# EAGLE board SDA381V3 (EAGLE 9.6.2), part 1 of 5
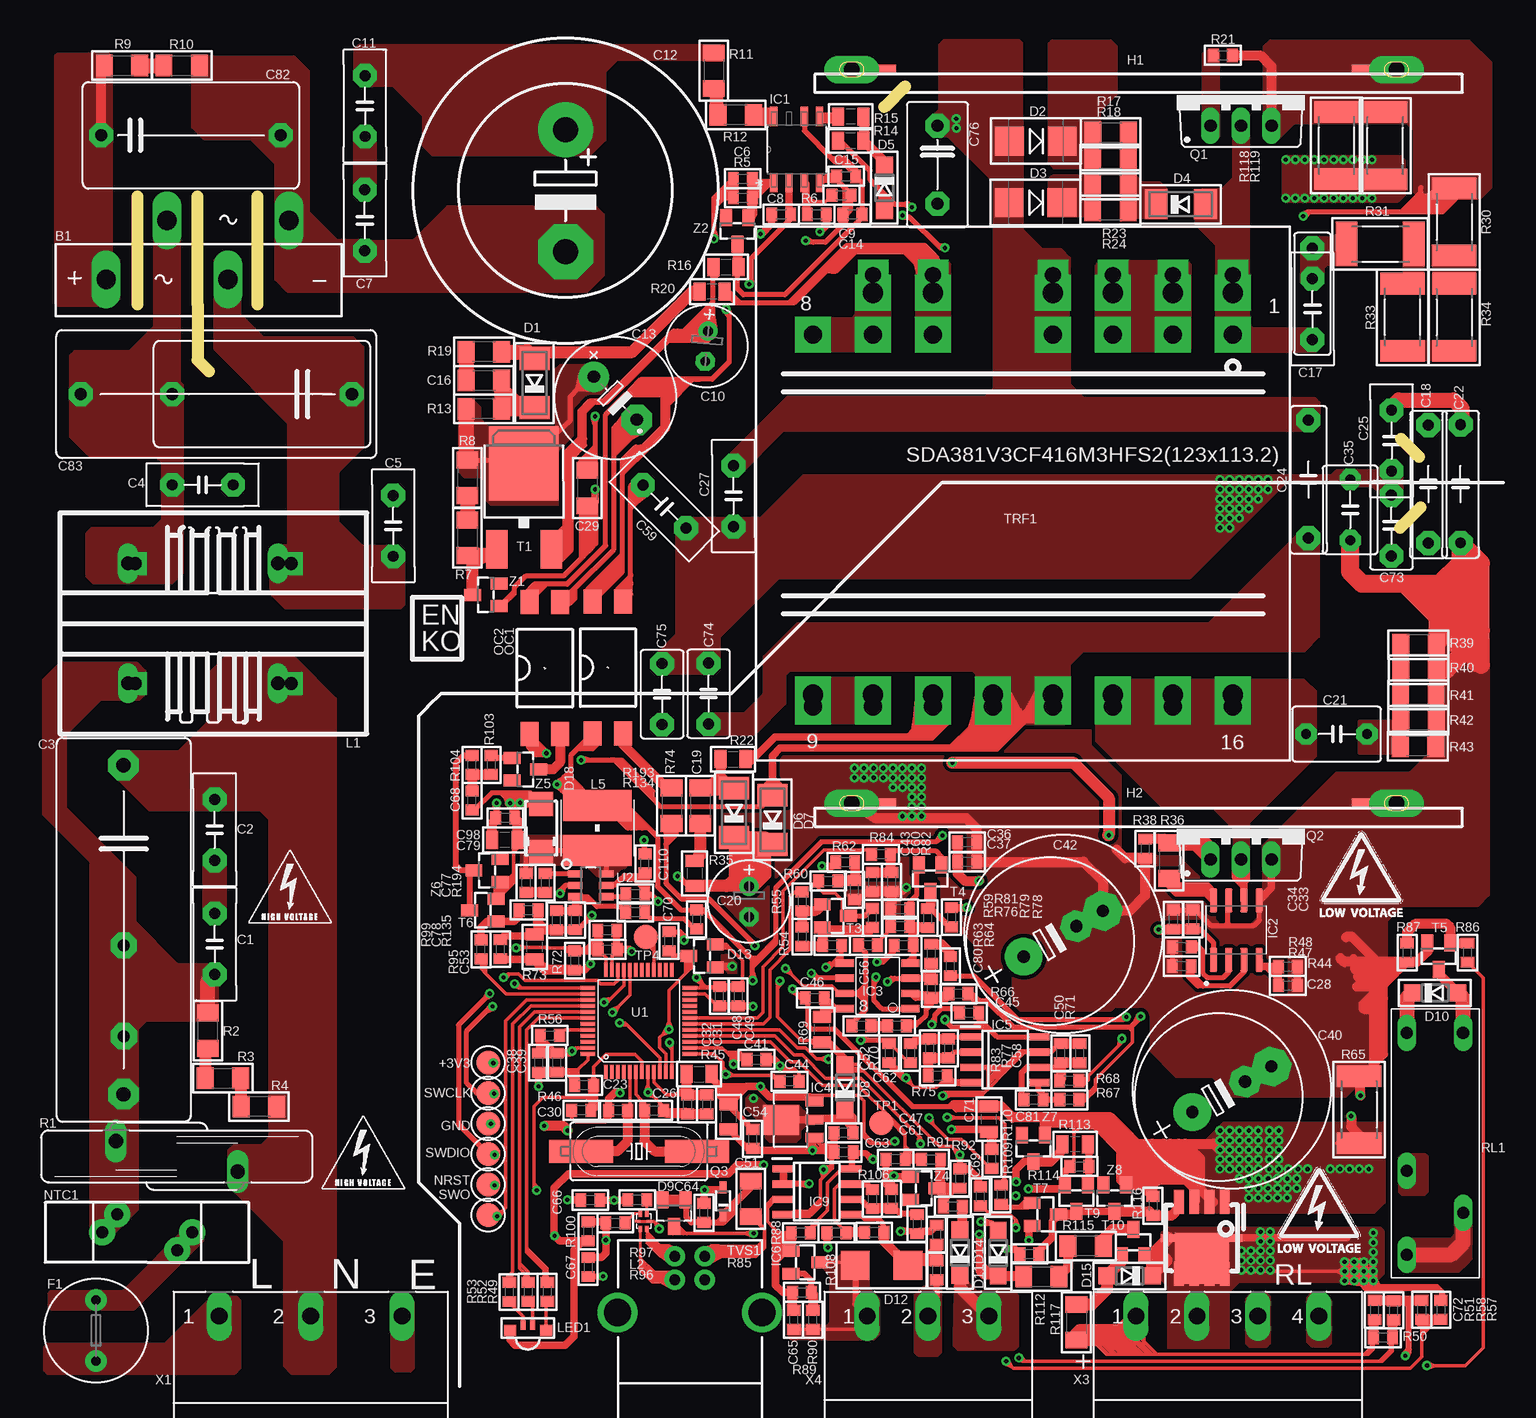
[diagram p3: board, top side]
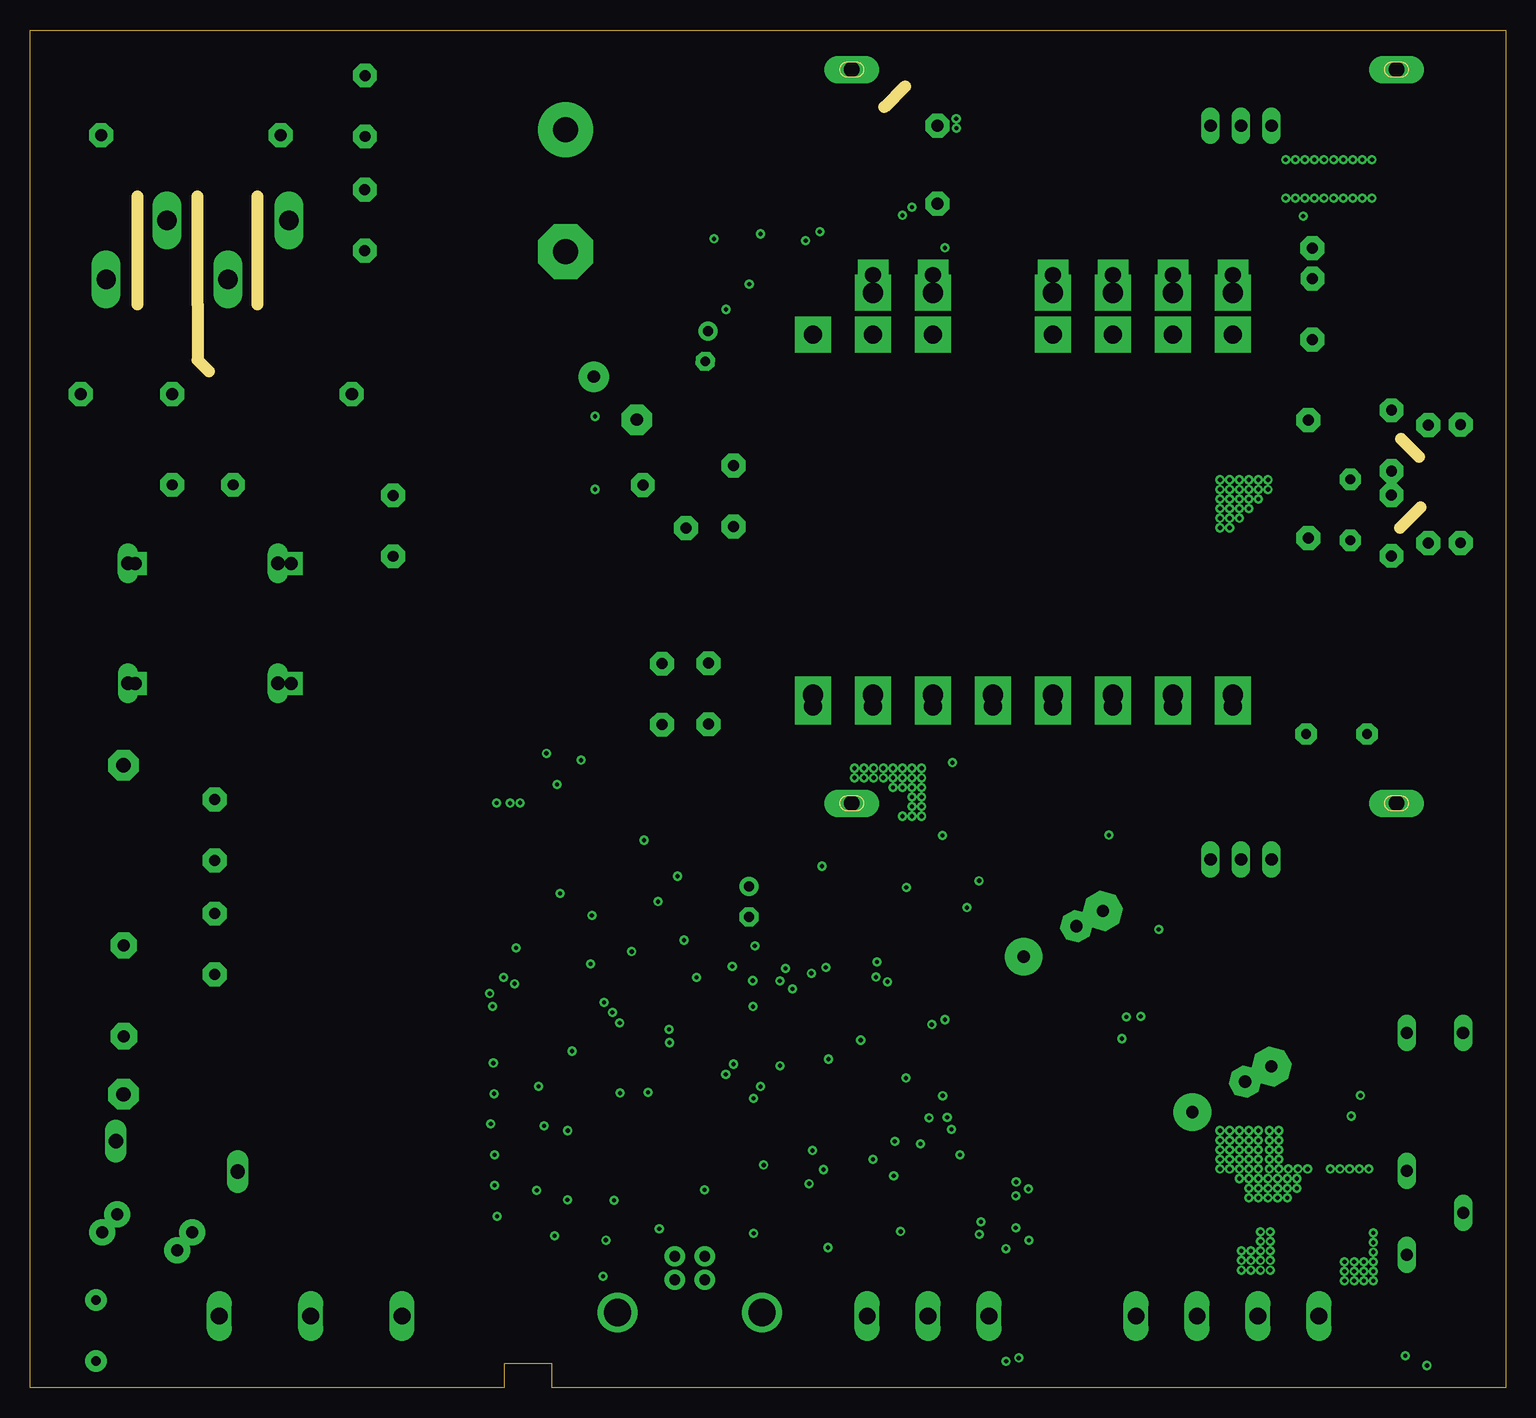
[diagram p4: board, inner layer Route3]
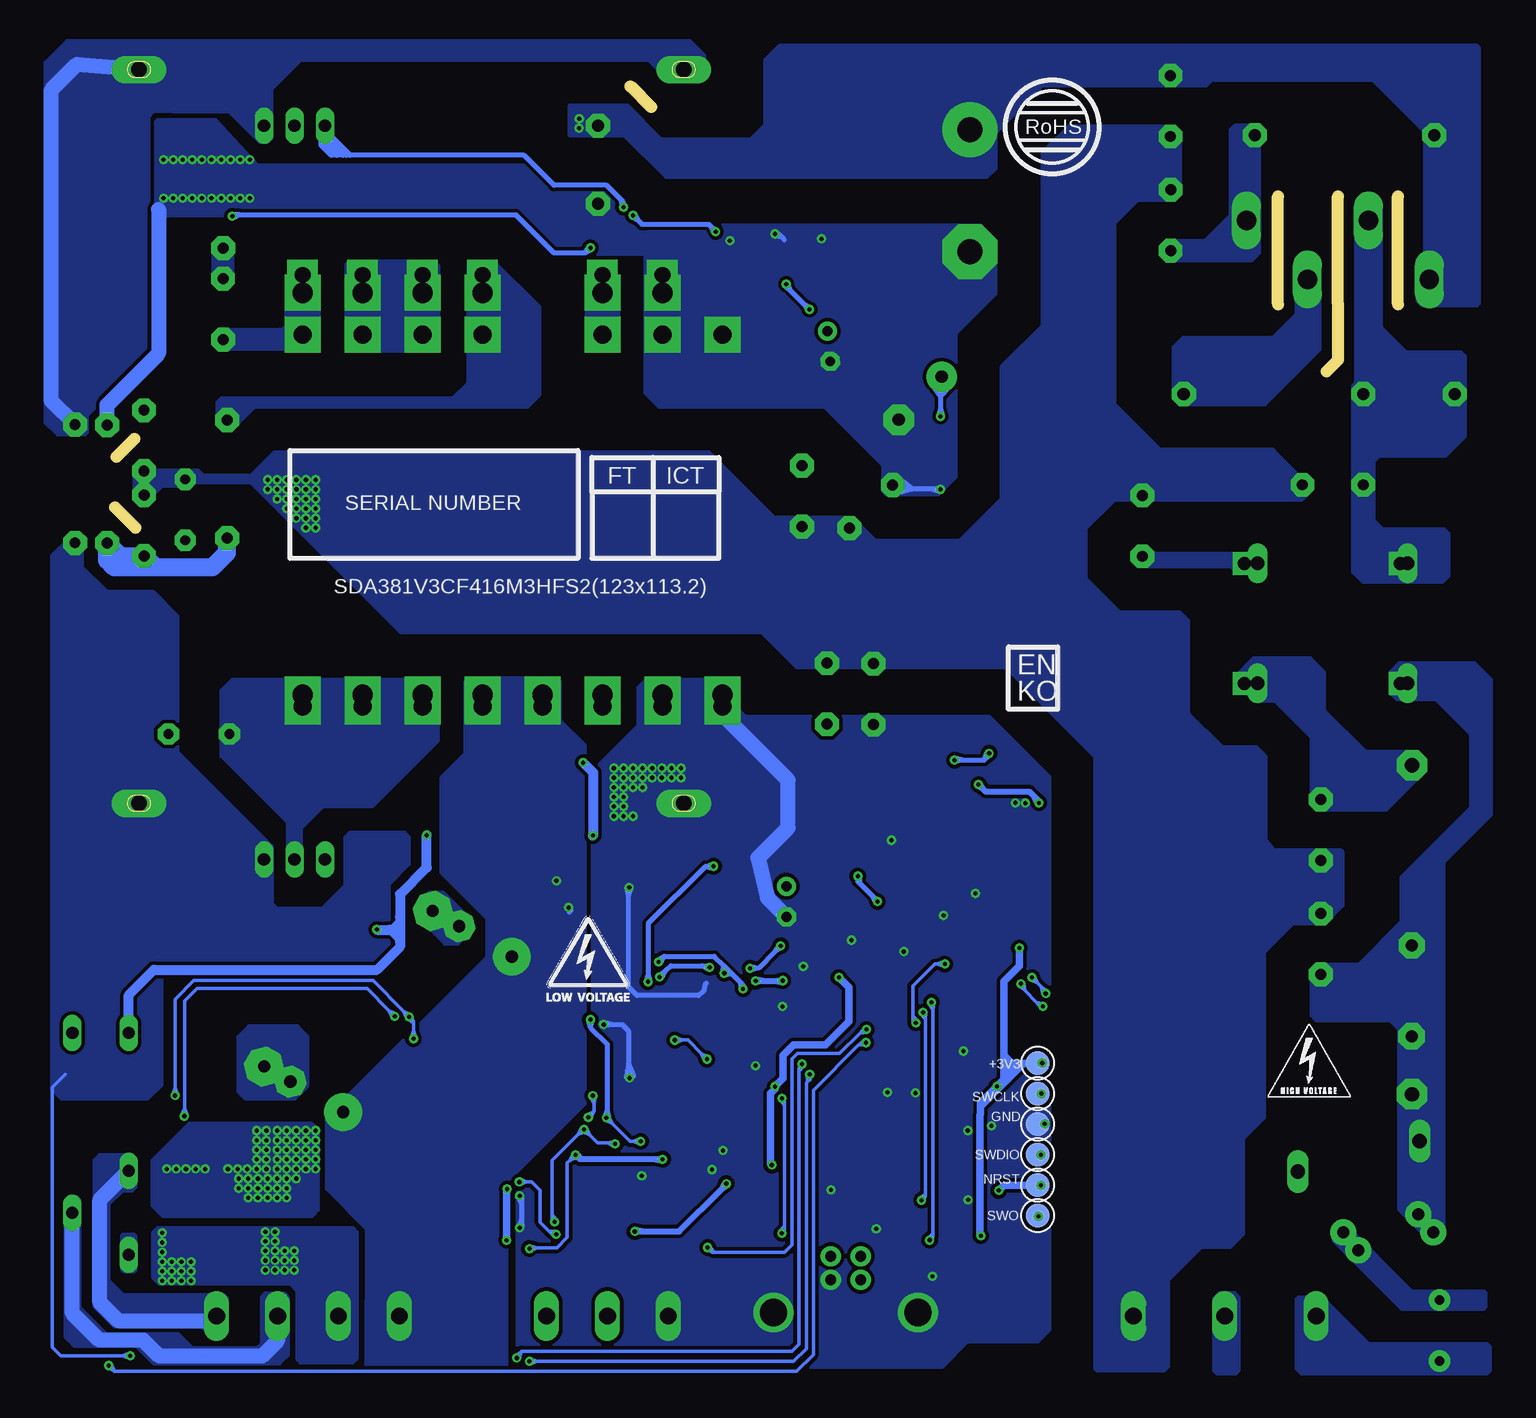
[diagram p5: board, bottom side, seen from below]

No outline drawn. Coordinates in mm, seen from the top.
Copper layers (1*16): Top 0.035mm / dielectric 1.53mm / Bottom 0.035mm
Design rules "default *": minimum track width 10mil, minimum drill 0.008890625mm, track to track 11mil, track to pad 11mil, pad to pad 11mil, via to via 11mil, smd to smd 11mil, copper to edge 6mil, drill to drill 8mil, minimum pad ring 10mil, minimum via ring 8mil, stop-mask expansion 4mil, vias tented up to drill 0.35mm, thermal gap 10mil
Milling: 5 lines

## Footprints (pad centres in the part's own frame; a part is rotated, then mirrored left to right if it is on the bottom)
DıODE_BRIDGE_8A_DIK = drill 1.6 long: + -7.62,0.08; - 7.62,5; AC1 -2.54,5; AC2 2.54,0.08
C50-035X75 = drill 0.914 pad 1.981 octagon: 1 -2.54,0; 2 2.54,0
C275-113X316_&_C150-072X183_&_C225-113X268 = drill 1.194 pad 2.54 octagon: 1 -13.716,0; 2 13.716,0 | drill 1.016 pad 2.184 octagon: 3 -13.733,0.02; 4 8.873,0.02; 5 -13.693,0; 6 1.293,0
C0603_ENKO = smd 0.9 x 1.1: 1 -0.794,0; 2 0.794,0
E2,5-7 = drill 0.813 pad 1.6: + -1.27,0 | drill 0.813 pad 1.6 octagon: - 1.27,0
EB25D = drill 2.1 pad 4.597: + -5.08,0 | drill 2.1 pad 4.597 octagon: - 5.08,0
E5-10,5 = drill 1.016 pad 2.54: + -2.54,0 | drill 1.016 pad 2.54 octagon: - 2.54,0
C1206_ENKO = smd 1.4 x 1.8: 1 -1.479,0; 2 1.479,0
C075-32X103/C050-035X75 = drill 0.914 pad 2 octagon: 1 -3.81,0; 2 3.81,0 | drill 0.914 pad 1.981 octagon: 3 -3.81,0; 4 1.27,0
C075-32X103_DEIF = drill 0.914 pad 2 octagon: P$1 -4.92,0; P$2 4.92,0
C050-045X075 = drill 0.813 pad 1.778 octagon: 1 -2.54,0; 2 2.54,0
E5-13/E7,5-16 = drill 1.016 pad 3.15: + -3.81,0 | drill 1.016 pad 2.54: +1 -3.81,0 | drill 1.016 pad 3.15 octagon: - 3.81,0 | drill 1.016 pad 2.54 octagon: -1 1.27,0
C0805_ENKO = smd 1 x 1.5: 1 -1.052,0; 2 1.052,0
C050-035X075 = drill 0.914 pad 1.981 octagon: 1 -2.54,0; 2 2.54,0
C065-052X106 = drill 1 pad 2 octagon: 1 -3.25,0; 2 3.25,0
C150-091X182 = drill 1 pad 2 octagon: 1 -7.493,0; 2 7.493,0
C150-091X182_C225-108X268 = drill 1.016 pad 2 octagon: 1 -11.303,0; 2 11.303,0; 3 -11.303,0; 4 3.683,0
M7_DC_DIYOT = smd 1.9 x 2.5: A -2.05,0; C 2.05,0
SMB = smd 2.4 x 2.4: A 2.2,0; C -2.2,0
SOD123 = smd 1.4 x 1.4: A 1.9,0; C -1.9,0
SOT23 = smd 1 x 1.4: 1 -0.95,-1.1; 2 0.95,-1.1; 3 0,1.1
TRANSIL_SMB = smd 2.4 x 2.4: A 2.2,0; A1 -2.2,0
SMA = smd 2 x 2: A 2,0; C -2,0
SENS_FUSE = drill 0.813 pad 1.778: 1 -2.54,0; 2 2.54,0
DEIF_SOGUTUCU_2 = drill 1.3 pad 2.3 long: 1 -23.9,0.91; 3 21.5,0.91 | smd 4.3 x 0.8: 2 -22.35,0.91; 4 19.95,0.91
NCP1239_SMPS_IC = smd 1.6 x 0.6: 1 -2.76,1.905; 2 -2.76,0.635; 3 -2.76,-0.635; 4 -2.76,-1.905; 5 2.76,-1.905; 6 2.76,-0.635; 8 2.76,1.905
NCP4306 = smd 1.97 x 0.6: 1 -2.475,1.905; 2 -2.475,0.635; 3 -2.475,-0.635; 4 -2.475,-1.905; 5 2.475,-1.905; 6 2.475,-0.635; 7 2.475,0.635; 8 2.475,1.905
SO-8 = smd 1.524 x 0.61: 1 -2.743,1.92; 2 -2.743,0.65; 3 -2.743,-0.62; 4 -2.743,-1.89; 5 2.743,-1.89; 6 2.743,-0.62; 7 2.743,0.65; 8 2.743,1.92
SOT89 = smd 0.8 x 1.5: 1 -1.5,-1.75; 2 0,-1.75; 3 1.5,-1.75 | smd 2.5 x 3: 4 0,1.05
SO08 = smd 0.6 x 1.8: 1 -1.905,-2.8; 2 -0.635,-2.8; 3 0.635,-2.8; 4 1.905,-2.8; 5 1.905,2.8; 6 0.635,2.8; 7 -0.635,2.8; 8 -1.905,2.8
TL431_SOT23F = smd 1 x 1.4: A 0,1.2; C -0.95,-1.2; R 0.95,-1.2
TPH6R30ANL = smd 0.8 x 2: D 1.905,3; D1 0.635,3; D2 -0.635,3; D3 -1.905,3; GATE 1.905,-3; S -1.905,-3; S1 -0.635,-3; S2 0.635,-3 | smd 1.27 x 0.635: P$1 -2.75,0; P$2 2.75,0 | smd 4.5 x 4.25: P$3 0,1.7
UU1620_&_FWCMET24V = drill 1.1 pad 1.93 square: 1 -5,-6.5; 2 5,-6.5; 3 -5,6.5; 4 5,6.5 | drill 1.118 long: 5 -5,-5.385; 6 5,-5.385; 7 4.999,7.115; 8 -5.001,7.113
EXC24CS_COMMON_MODE = smd 0.4 x 0.2: 1 -0.5,0; 4 0.5,0 | smd 0.3 x 0.5: 2 -0.275,-0.625; 3 0.275,-0.625; 5 0.275,0.625; 6 -0.275,0.625
WE-PD2_5MM = smd 2.55 x 5.7: 1 -1.875,0; 2 1.875,0
KPFA-3010RGBC-11 = smd 1 x 0.9: 1 1.5,-0.2; 2 -1.5,-0.2 | smd 0.4 x 0.8: 3 -0.4,0.25; 4 0.4,0.25
NTC_15R_2A_&_N15SP005-5 = drill 1 pad 2.184: P$1 -2.5,1.5; P$2 2.5,-1.5; P$3 3.75,0; P$4 -3.75,0
PS2561DL2-1_OPTO1 = smd 1.5 x 2: 1 -1.27,-5.5; 2 1.27,-5.5; 3 1.27,5.5; 4 -1.27,5.5
PROG_6PIN = smd 2 x 2: 1 0,6.35; 2 0,3.81; 3 0,1.27; 4 0,-1.27; 5 0,-3.81; 6 0,-6.35
TO220BV = drill 1.016 long: D 0,-2.54; G -2.54,-2.54; S 2.54,-2.54
HC49UP = smd 5.334 x 1.93: 1 -4.826,0; 2 4.826,0
S20K40 = drill 1.194 long: 1 -1.27,-5.08; 2 1.27,5.08
R1206_ENKO = smd 1.4 x 1.8: 1 -1.479,0; 2 1.479,0
R0603_ENKO = smd 0.9 x 1.1: 1 -0.794,0; 2 0.794,0
R0805_ENKO = smd 1 x 1.5: 1 -1.052,0; 2 1.052,0
R2512 = smd 1.8 x 3.7: 1 -2.8,0; 2 2.8,0
ALD1_AND_ALJ_RELAY = drill 1.016 pad 1.27 long: 1 -8.997,-2.129; 2 -8.998,2.565; P0 9.505,-2.132; P1 6.007,2.571; S0 2.507,-2.129
DPAK = smd 1.8 x 3.2: 1 -2.28,-4.8; 3 2.28,-4.8 | smd 5.8 x 6.2: 4 0,2.38
SOT23-BEC = smd 1 x 1.4: B -0.95,-1.1; C 0,1.1; E 0.95,-1.1
TP20R = smd 2 x 2: TP 0,0
DEIF_TRF = drill 1.7 pad 3 square: 1 -16.75,12.5; 2 -16.75,7.5; 3 -16.75,2.5; 5 -16.75,-7.5; 6 -16.75,-12.5; 6.5 16.75,-17.5; 7 16.75,-12.5; 8 16.75,-7.5; 9 16.75,-2.5; 10 16.75,2.5; 11 16.75,7.5; 12 16.75,12.5; 13 16.75,17.5; 55 -16.75,17.5 | drill 1.5 pad 3 square: 6.1 17.745,-17.5; 6.2 16.75,-17.5; 19 17.745,12.5; 20 17.745,7.5; 21 17.745,2.5; 22 17.745,-2.5; 23 17.745,-7.5; 24 17.745,-12.5; 25 17.745,17.5; 27 16.75,-12.5; 28 16.75,-7.5; 29 16.75,-2.5; 30 16.75,2.5; 31 16.75,7.5; 32 16.75,12.5; 38 16.75,17.5; 40 16.75,-17.5; 41 16.75,-12.5; 42 16.75,-7.5; 43 16.75,-2.5; 44 16.75,2.5; 45 16.75,7.5; 46 16.75,12.5; 47 16.75,17.5; 48 -13.25,-17.5; 49 -13.25,-12.5; 50 -13.25,-7.5; 52 -13.25,2.5; 53 -13.25,7.5; 54 -13.25,12.5; 58 -13.25,17.5 | drill 1.3 pad 2.54 square: 14 -18.255,-12.5; 15 -18.255,-7.5; 16 -18.255,2.5; 17 -18.255,7.5; 18 -18.255,12.5; 33 -18.25,-12.5; 34 -18.25,-7.5; 35 -18.25,2.5; 36 -18.25,7.5; 37 -18.25,12.5; 56 -18.255,17.5; 57 -18.25,17.5
SOD323 = smd 1 x 0.6: A 1.143,0; C -1.143,0
STM32F072CXXX_LQFP48 = smd 0.3 x 1.2: 1 -2.75,-4.25; 2 -2.25,-4.25; 3 -1.75,-4.25; 4 -1.25,-4.25; 5 -0.75,-4.25; 6 -0.25,-4.25; 7 0.25,-4.25; 8 0.75,-4.25; 9 1.25,-4.25; 10 1.75,-4.25; 11 2.25,-4.25; 12 2.75,-4.25; 25 2.75,4.25; 26 2.25,4.25; 27 1.75,4.25; 28 1.25,4.25; 29 0.75,4.25; 30 0.25,4.25; 31 -0.25,4.25; 32 -0.75,4.25; 33 -1.25,4.25; 34 -1.75,4.25; 35 -2.25,4.25; 36 -2.75,4.25 | smd 1.2 x 0.3: 13 4.25,-2.75; 14 4.25,-2.25; 15 4.25,-1.75; 16 4.25,-1.25; 17 4.25,-0.75; 18 4.25,-0.25; 19 4.25,0.25; 20 4.25,0.75; 21 4.25,1.25; 22 4.25,1.75; 23 4.25,2.25; 24 4.25,2.75; 37 -4.25,2.75; 38 -4.25,2.25; 39 -4.25,1.75; 40 -4.25,1.25; 41 -4.25,0.75; 42 -4.25,0.25; 43 -4.25,-0.25; 44 -4.25,-0.75; 45 -4.25,-1.25; 46 -4.25,-1.75; 47 -4.25,-2.25; 48 -4.25,-2.75
AOZ1282CI-1 = smd 1.2 x 0.6: 1 -1.298,0.95; 2 -1.298,0; 3 -1.298,-0.95; 4 1.298,-0.95; 5 1.298,0; 6 1.298,0.95
GMSTBA3 = drill 1.397 long: 1 -7.62,5.08; 2 0,5.08; 3 7.62,5.08
USB_B(YATIK) = drill 0.914 pad 1.676: D+ 4,1.25; D- 5.981,1.25; GND 4,-1.25; VBUS 5.981,-1.25 | drill 2.286: SHLD1 1.282,-6.02; SHLD2 1.282,6.02
MSTBA4 = drill 1.397 long: 1 -7.62,5.08; 2 -2.54,5.08; 3 2.54,5.08; 4 7.62,5.08
MSTBA3 = drill 1.397 long: 1 -5.08,5.08; 2 0,5.08; 3 5.08,5.08

## Placement (x,y rotation side)
B1  0119-1152**DIODE BRIDGE 8A 800V 4-SIP, GBU  [DıODE_BRIDGE_8A_DIK]  -109.03,92.33 0 top
C1  NC**TAKILMAYACAK (Not Fitted)  [C50-035X75]  -107.6,37 270 top
C2  NC**TAKILMAYACAK (Not Fitted)  [C50-035X75]  -107.61,46.52 90 top
C3  0019-2209**CAP TH POLY 2.2uF 305Vac %10 X2 Metalize PP F=27.5mm (32x25x13)  [C275-113X316_&_C150-072X183_&_C225-113X268]  -115.19,38.19 270 top
C4  0019-1391**CAP TH CER 4700pF 250VAC 2.5kVDC X1Y2 %20 85C F=5mm  [C50-035X75]  -108.61,75.28 180 top
C5  0019-1391**CAP TH CER 4700pF 250VAC 2.5kVDC X1Y2 %20 85C F=5mm  [C50-035X75]  -92.72,71.87 90 top
C6  1200920252**CAP 0603 CER 1nF 50V %10 X7R  [C0603_ENKO]  -63.58,100.8 180 top
C7  0019-1391**CAP TH CER 4700pF 250VAC 2.5kVDC X1Y2 %20 85C F=5mm  [C50-035X75]  -95.09,97.35 270 top
C8  1200920252**CAP 0603 CER 1nF 50V %10 X7R  [C0603_ENKO]  -60.38,97.83 180 top
C9  1200920371**CAP 0603 CER 150p 50V%5 COG  [C0603_ENKO]  -55.36,99.42 180 top
C10  0019-2279**CAP TH AL ELEC 47uF 50V %20 105C F=2.5/6.3x11 Low ESR, High Ripple Current  [E2,5-7]  -66.6,86.84 265 top
C11  0019-1391**CAP TH CER 4700pF 250VAC 2.5kVDC X1Y2 %20 85C F=5mm  [C50-035X75]  -95.08,106.86 90 top
C12  0019-3039**150uF 450V 105C %20 Ba:10 Yu: 41,5 çap: 25  [EB25D]  -78.36,99.81 270 top
C13  0019-2196**CAP TH AL ELEC 47uF 100V %20 105C F=5/10x16  [E5-10,5]  -74.21,82.5 315 top
C14  1200920567**CAP 0603 CER 1uF 25V %10X7R  [C0603_ENKO]  -54.44,97.83 180 top
C15  1200920268**CAP 0603 CER 100nF 50V %10 X7R  [C0603_ENKO]  -54.97,101 180 top
C16  NC**TAKILMAYACAK (Not Fitted)  [C1206_ENKO]  -85.16,83.98 180 top
C17  0019-5004**CAP TH CER 100pF 1kV Y5V %10 85C F=5  [C075-32X103/C050-035X75]  -16.09,91.21 90 top
C18  1200920292**CAP TH CER 2.2nF 300Vac %20 X1Y2 F=7.5mm DxS(13x5)  [C075-32X103_DEIF]  -6.42,75.36 90 top
C19  1200920078**CAP 1206 CER 1nF 50V %10 X7R  [C1206_ENKO]  -67.14,48.54 90 top
C20  1200920283**CAP TH AL. ELEC 47uF 50V %20 105C L?1000H F=2.5/6.3x11  [E2,5-7]  -63.06,40.54 270 top
C21  0019-3003**CAP TH CER 3.3nF 2000VDC %10 Y5P/Y5E F=5mm  [C050-045X075]  -14.08,54.51 0 top
C22  NC**TAKILMAYACAK (Not Fitted)  [C075-32X103_DEIF]  -3.75,75.37 90 top
C23  1019-3352**CAP 0603 CER 22pF 50V %5 NPO  [C0603_ENKO]  -73.99,23.15 180 top
C24  NC**TAKILMAYACAK (Not Fitted)  [C075-32X103_DEIF]  -16.43,75.75 90 top
C25  NC**TAKILMAYACAK (Not Fitted)  [C50-035X75]  -9.5,78.96 90 top
C26  1019-3352**CAP 0603 CER 22pF 50V %5 NPO  [C0603_ENKO]  -70.98,23.13 0 top
C27  NC**TAKILMAYACAK (Not Fitted)  [C50-035X75]  -64.36,74.35 90 top
C28  1200920268**CAP 0603 CER 100nF 50V %10 X7R  [C0603_ENKO]  -18.14,33.54 180 top
C29  NC**TAKILMAYACAK (Not Fitted)  [C1206_ENKO]  -76.53,75.01 90 top
C30  1200920268**CAP 0603 CER 100nF 50V %10 X7R  [C0603_ENKO]  -77.05,23.15 0 top
C31  1200920268**CAP 0603 CER 100nF 50V %10 X7R  [C0603_ENKO]  -66.59,23.63 270 top
C32  1019-3167**CAP 0603 CER 10nF 50V %10 X7R (AbC)  [C0603_ENKO]  -68.19,23.63 270 top
C33  1200920268**CAP 0603 CER 100nF 50V %10 X7R  [C0603_ENKO]  -26.08,39.04 270 top
C34  1200920567**CAP 0603 CER 1uF 25V %10X7R  [C0603_ENKO]  -27.69,39.04 270 top
C35  0019-1391**CAP TH CER 4700pF 250VAC 2.5kVDC X1Y2 %20 85C F=5mm  [C050-045X075]  -12.94,73.2 90 top
C36  1200920268**CAP 0603 CER 100nF 50V %10 X7R  [C0603_ENKO]  -44.88,45.49 0 top
C37  1200920268**CAP 0603 CER 100nF 50V %10 X7R  [C0603_ENKO]  -44.88,43.86 0 top
C38  1200920268**CAP 0603 CER 100nF 50V %10 X7R  [C0603_ENKO]  -80.59,27.11 90 top
C39  1019-3167**CAP 0603 CER 10nF 50V %10 X7R (AbC)  [C0603_ENKO]  -79.09,27.12 90 top
C40  0019-3054**CAP TH AL ELEC 1000uF 35V %20 105C F=5/16x20 LOW ESR [ARGE?]  [E5-13/E7,5-16]  -22.81,24.89 30 top
C41  1200920268**CAP 0603 CER 100nF 50V %10 X7R  [C0603_ENKO]  -62.43,27.37 0 top
C42  0019-3054**CAP TH AL ELEC 1000uF 35V %20 105C F=5/16x20 LOW ESR [ARGE?]  [E5-13/E7,5-16]  -36.87,37.86 30 top
C43  1019-3387**CAP 0603 CER 10uF 10V %10 X5R  [C0603_ENKO]  -54.28,41.52 90 top
C44  1200920268**CAP 0603 CER 100nF 50V %10 X7R  [C0603_ENKO]  -59.7,25.56 0 top
C45  1200920268**CAP 0603 CER 100nF 50V %10 X7R  [C0603_ENKO]  -44.7,31.28 180 top
C46  1200920268**CAP 0603 CER 100nF 50V %10 X7R  [C0603_ENKO]  -57.58,32.51 0 top
C47  1200920567**CAP 0603 CER 1uF 25V %10X7R  [C0603_ENKO]  -55.18,21.27 180 top
C48  1019-3167**CAP 0603 CER 10nF 50V %10 X7R (AbC)  [C0603_ENKO]  -65.53,32.65 270 top
C49  1200920268**CAP 0603 CER 100nF 50V %10 X7R  [C0603_ENKO]  -63.97,32.65 270 top
C50  NC**TAKILMAYACAK (Not Fitted)  [C0603_ENKO]  -37.08,27.91 90 top
C51  1200920268**CAP 0603 CER 100nF 50V %10 X7R  [C0603_ENKO]  -62.76,20.76 270 top
C52  1200920567**CAP 0603 CER 1uF 25V %10X7R  [C0603_ENKO]  -53.7,30.2 180 top
C53  1200920268**CAP 0603 CER 100nF 50V %10 X7R  [C0603_ENKO]  -83.79,36.57 90 top
C54  1019-3301**CAP 0805 47uF 6.3V %20 X5R  [C0805_ENKO]  -64.77,22.59 270 top
C55  1019-3167**CAP 0603 CER 10nF 50V %10 X7R (AbC)  [C0603_ENKO]  -74.86,36.54 0 top
C56  1019-3167**CAP 0603 CER 10nF 50V %10 X7R (AbC)  [C0603_ENKO]  -53.14,36.9 180 top
C57  1200920268**CAP 0603 CER 100nF 50V %10 X7R  [C0603_ENKO]  -74.88,38.15 0 top
C58  1200920371**CAP 0603 CER 150p 50V%5 COG  [C0603_ENKO]  -46.43,28.3 90 top
C59  NC**TAKILMAYACAK (Not Fitted)  [C50-035X75]  -70.12,73.47 135 top
C60  1019-3387**CAP 0603 CER 10uF 10V %10 X5R  [C0603_ENKO]  -52.76,42.18 90 top
C61  1200920268**CAP 0603 CER 100nF 50V %10 X7R  [C0603_ENKO]  -55.16,19.66 180 top
C62  1200920268**CAP 0603 CER 100nF 50V %10 X7R  [C0603_ENKO]  -51.37,27.92 90 top
C63  1019-3167**CAP 0603 CER 10nF 50V %10 X7R (AbC)  [C0603_ENKO]  -50.84,19.06 180 top
C64  1200920268**CAP 0603 CER 100nF 50V %10 X7R  [C0603_ENKO]  -66.83,14.59 90 top
C65  1200920268**CAP 0603 CER 100nF 50V %10 X7R  [C0603_ENKO]  -59.34,5.67 90 top
C66  1019-3381**CAP 0603 CER 33pf 50V %5 NPO(COG)  [C0603_ENKO]  -76.29,15.66 180 top
C67  1019-3381**CAP 0603 CER 33pf 50V %5 NPO(COG)  [C0603_ENKO]  -76.47,10.08 270 top
C68  1200920268**CAP 0603 CER 100nF 50V %10 X7R  [C0603_ENKO]  -86.15,48.96 90 top
C69  1200920268**CAP 0603 CER 100nF 50V %10 X7R  [C0603_ENKO]  -43.77,15.96 90 top
C70  1200920268**CAP 0603 CER 100nF 50V %10 X7R  [C0603_ENKO]  -69.74,37.23 270 top
C71  1200920082**CAP 0805 CER 100nF 50V %10 X7R  [C0805_ENKO]  -43.05,22.41 90 top
C72  1019-3167**CAP 0603 CER 10nF 50V %10 X7R (AbC)  [C0603_ENKO]  -10.92,6.5 270 top
C73  0019-1391**CAP TH CER 4700pF 250VAC 2.5kVDC X1Y2 %20 85C F=5mm  [C050-035X075]  -9.51,71.9 90 top
C74  NC**TAKILMAYACAK (Not Fitted)  [C050-035X075]  -66.43,57.87 90 top
C75  NC**TAKILMAYACAK (Not Fitted)  [C050-035X075]  -70.31,57.83 270 top
C76  NC**TAKILMAYACAK (Not Fitted)  [C065-052X106]  -47.36,101.98 270 top
C77  1200920268**CAP 0603 CER 100nF 50V %10 X7R  [C0603_ENKO]  -81.64,42.1 90 top
C78  1200920271**CAP 0603 CER 10pF 50V%10 COG  [C0603_ENKO]  -79.11,38.98 270 top
C79  1019-3243**CAP 0805 CER 10uF 50V ±10% X5R -55°C ~ 85°C  [C0805_ENKO]  -83.42,45.67 180 top
C80  NC**TAKILMAYACAK (Not Fitted)  [C0603_ENKO]  -47.87,33.26 90 top
C81  NC**TAKILMAYACAK (Not Fitted)  [C0603_ENKO]  -39.34,24.03 0 top
C82  NC**TAKILMAYACAK (Not Fitted)  [C150-091X182]  -109.59,104.42 0 top
C83  0019-1383**CAP TH POLY 220nF 305Vac 105C %20 X2 F=15/7x13.5x18  [C150-091X182_C225-108X268]  -107.47,82.84 180 top
C98  1200920252**CAP 0603 CER 1nF 50V %10 X7R  [C0603_ENKO]  -83.39,47.52 180 top
C110  1200920268**CAP 0603 CER 100nF 50V %10 X7R  [C0603_ENKO]  -71.74,43.72 270 top
D1  1200980554**DIODE SWITCHING SM 1000V 1A US1M  [M7_DC_DIYOT]  -80.94,83.77 270 top
D2  1119-3023**TVS DIODE SMB P6SMB200A-TKS (Reverse Standoff Voltage 171V) ( MAXIMUM CLAMPING 274V)  [SMB]  -39.16,103.94 180 top
D3  1119-3023**TVS DIODE SMB P6SMB200A-TKS (Reverse Standoff Voltage 171V) ( MAXIMUM CLAMPING 274V)  [SMB]  -39.18,98.81 180 top
D4  1200980554**DIODE SWITCHING SM 1000V 1A US1M  [M7_DC_DIYOT]  -27.07,98.66 180 top
D5  1200980377**DIODE SWITCHING SMD 75V 200mA SOD-123 1N4148W  [SOD123]  -51.78,100.05 270 top
D6  1200980554**DIODE SWITCHING SM 1000V 1A US1M  [M7_DC_DIYOT]  -64.31,47.94 270 top
D7  1200980468**DIODE RECTIFIER SMD 1000V 1A GS1M  [M7_DC_DIYOT]  -61.11,47.36 270 top
D8  1200980377**DIODE SWITCHING SMD 75V 200mA SOD-123 1N4148W  [SOD123]  -55.05,25.05 90 top
D9  1119-3027**DIODE 75V 200MA SOT23 BAS16 (AbC)  [SOT23]  -69.32,14.57 180 top
D10  1200980377**DIODE SWITCHING SMD 75V 200mA SOD-123 1N4148W  [SOD123]  -5.88,32.93 0 top
D11  1200980377**DIODE SWITCHING SMD 75V 200mA SOD-123 1N4148W  [SOD123]  -45.48,11.28 90 top
D12  1039-3023**DIODE TVS 600W 12V DO214AA BIPOLAR  [TRANSIL_SMB]  -52.01,10.22 0 top
D13  1200980593**DIODE SCHOTTKY BARRIER DOUBLE SMD 30V 200mA BAT54S  [SOT23]  -66.98,36.02 90 top
D14  1200980377**DIODE SWITCHING SMD 75V 200mA SOD-123 1N4148W  [SOD123]  -42.29,11.24 90 top
D15  1200980377**DIODE SWITCHING SMD 75V 200mA SOD-123 1N4148W  [SOD123]  -31.34,9.34 180 top
D18  1200980432**DIODE SCHOTTKY RECTIFIER SMD SMA/DO_214AC 60V 2A STPS2L60A  [SMA]  -80.39,46.66 90 top
F1  0169-2042**SIGORTA 5A FAST-ACTING TR5 SERISI SILINDIRIK TIP  [SENS_FUSE]  -117.5,4.78 270 top
H1  0139-1110**DBC2 Heatsink [ARGE?]  [DEIF_SOGUTUCU_2]  -30.59,109 0 top
H2  0139-1110**DBC2 Heatsink [ARGE?]  [DEIF_SOGUTUCU_2]  -30.59,47.82 0 top
IC1  1039-9014**IC SMPS CONTROLLER FLYBACK FIXED FREQ. ONSEMI NCP1239ED65R2G  [NCP1239_SMPS_IC]  -59.09,103.24 90 top
IC2  1039-9013**NCP4306AADZZZADR2G SOIC-8 (senkron IC) Synchronous Rectification Controller for Flyback  [NCP4306]  -22.44,38.16 90 top
IC3  1039-2224**TSM1011ID SO-8 Constant Voltage and Constant Current Controller  [SO-8]  -52.34,33.53 180 top
IC4  1039-3003**Voltage Regulator SOT-89 3.3V Diodes AP2204RA-3.3TRG1  [SOT89]  -59.35,22.36 90 top
IC5  1039-2009**OPAMP 3-32 V Dual 70C SO8 LM358  [SO08]  -41.72,27.36 270 top
IC6  1200980448**IC REGULATOR VOLTAGE SMD ZTL431AFFTA 2.5V %1  [TL431_SOT23F]  -58.37,10.46 270 top
IC8  1109-4211**Mosfet N-Ch 100V 90A Rds:3.7mR 8-SOP Advance (5x5) TPH3R70APL  [TPH6R30ANL]  -25.33,12.5 180 top
IC9  1039-2009**OPAMP 3-32 V Dual 70C SO8 LM358  [SO08]  -57.41,16.36 270 top
L1  0319-7445**LINE FILTER 2x5,9mH 4A 55mR 11.5mm COMMON MODE CHOKE Kemet SSRH24NVS-40059  [UU1620_&_FWCMET24V]  -107.72,63.73 90 top
L2  1319-4100**EXC24 Common Mode Noise Filters with ESD Suppressor(0504 Size)  [EXC24CS_COMMON_MODE]  -71.85,13.9 0 top
L5  1319-4102**INDUCTOR POWER 22UH 4X4X1.8MM SMD  [WE-PD2_5MM]  -75.7,46.68 270 top
LED1  1209-0011**LED, RGB, Red, Green, Blue, SMD, 1mm x 3mm, 120 °, Dome, R 20mA, G 20mA, B 20mA (Right Angle)  [KPFA-3010RGBC-11]  -81.5,5 0 top
NTC1  0169-2029**SURGE PROTECTOR-In rush Current Limitter NTC N10SP005  [NTC_15R_2A_&_N15SP005-5]  -113.24,12.96 0 top
OC1  1200980560**OPTOCOUPLER SMD PS2561DL2-1Y-V-F3-A/L CTR: 200˜400  [PS2561DL2-1_OPTO1]  -74.82,60.05 0 top
OC2  1200980560**OPTOCOUPLER SMD PS2561DL2-1Y-V-F3-A/L CTR: 200˜400  [PS2561DL2-1_OPTO1]  -80.09,60 0 top
PCB1  0369-5034**PCB [ARGE?] SDA381V2CF416M3HFS2(123x113.2)  [PCB]  -332.88,140.12 0 top
PROG1  NC**TAKILMAYACAK (Not Fitted)  [PROG_6PIN]  -84.02,20.71 0 bottom
PROG2  NC**TAKILMAYACAK (Not Fitted)  [PROG_6PIN]  -84.81,20.77 0 top
Q1  0109-4091**Mosfet N-Ch 800V 9A 0.16R TO-220FP Vishay SIHA24N80AE-GE3 [ARGE?]  [TO220BV]  -22.05,107.76 0 top
Q2  0109-4112**Mosfet N-Ch 27.4A 150V Rds:19mR TO-220F Fairchild FDPF190N15A  [TO220BV]  -22.05,46.59 0 top
Q3  1149-0006**HC49S SMD KRISTAL 8MHZ -40+85 20PF 50PPM FAT Y3MM  [HC49UP]  -72.24,19.73 0 top
R1  0169-2013**Varistor 20mm 300V  [S20K40]  -110.77,19.31 270 top
R2  1200970587**RES 1206 470K %5 1/4W  [R1206_ENKO]  -108.17,29.78 270 top
R3  1200970587**RES 1206 470K %5 1/4W  [R1206_ENKO]  -106.92,25.83 180 top
R4  1200970587**RES 1206 470K %5 1/4W  [R1206_ENKO]  -103.91,23.44 0 top
R5  1200970687**RES 0603 56K %1 1/10W  [R0603_ENKO]  -63.58,99.22 0 top
R6  1200970583**RES 0603 1K %1 1/10W  [R0603_ENKO]  -57.41,97.83 0 top
R7  1029-4050**RES 1206 6K8 %1  [R1206_ENKO]  -86.54,70.87 90 top
R8  1029-4050**RES 1206 6K8 %1  [R1206_ENKO]  -86.53,75.86 90 top
R9  1200970179**RES 1206 330K %5 1/4W  [R1206_ENKO]  -115.32,110.24 180 top
R10  1200970179**RES 1206 330K %5 1/4W  [R1206_ENKO]  -110.35,110.23 180 top
R11  1200970154**RES 1206 2K2 %5 1/4W  [R1206_ENKO]  -66.01,109.8 90 top
R12  1200970154**RES 1206 2K2 %5 1/4W  [R1206_ENKO]  -64.16,106.12 0 top
R13  1200970601**RES 1206 10R %5 1/4W  [R1206_ENKO]  -85.17,81.61 0 top
R14  1200970118**RES 0805 100R %5 1/8W  [R0805_ENKO]  -54.59,103.99 0 top
R15  1029-3008**RES 0805 22R %5  [R0805_ENKO]  -54.59,105.98 180 top
R16  1319-4060**Ferrite Bead SMD 0805 2kOhm@100MHz 300mA LAIRD HZ0805C202R-10  [R0805_ENKO]  -64.98,93.45 0 top
R17  1029-3146**RES 1206 7R68 %1  [R1206_ENKO]  -32.91,104.63 0 top
R18  1029-3146**RES 1206 7R68 %1  [R1206_ENKO]  -32.93,102.44 0 top
R19  NC**TAKILMAYACAK (Not Fitted)  [R1206_ENKO]  -85.16,86.36 0 top
R20  1319-4060**Ferrite Bead SMD 0805 2kOhm@100MHz 300mA LAIRD HZ0805C202R-10  [R0805_ENKO]  -66.15,91.38 180 top
R21  1200970568**RES 0603 47K %5 1/10W  [R0603_ENKO]  -23.56,111.08 180 top
R22  1319-4060**Ferrite Bead SMD 0805 2kOhm@100MHz 300mA LAIRD HZ0805C202R-10  [R0805_ENKO]  -64.4,52.41 0 top
R23  1029-3146**RES 1206 7R68 %1  [R1206_ENKO]  -32.93,100.3 0 top
R24  1029-3146**RES 1206 7R68 %1  [R1206_ENKO]  -32.93,98.18 0 top
R30  1029-6109**RES 2512 33R %5 1W  [R2512]  -4.28,97.19 270 top
R31  1029-6109**RES 2512 33R %5 1W  [R2512]  -10.45,95.36 0 top
R33  1029-6109**RES 2512 33R %5 1W  [R2512]  -8.58,89.25 90 top
R34  1029-6109**RES 2512 33R %5 1W  [R2512]  -4.28,89.25 270 top
R35  1029-3116**RES 0805 10R %5  [R0805_ENKO]  -67.61,42.88 270 top
R36  1200970117**RES 1206 0R %5  [R1206_ENKO]  -28.04,43.95 90 top
R38  1200970568**RES 0603 47K %5 1/10W  [R0603_ENKO]  -30.05,44.96 270 top
R39  1200970228**RES 1206 47R %5 1/4W  [R1206_ENKO]  -7.26,61.95 0 top
R40  1200970228**RES 1206 47R %5 1/4W  [R1206_ENKO]  -7.26,59.87 0 top
R41  1200970228**RES 1206 47R %5 1/4W  [R1206_ENKO]  -7.26,57.78 0 top
R42  1200970228**RES 1206 47R %5 1/4W  [R1206_ENKO]  -7.26,55.64 0 top
R43  1200970228**RES 1206 47R %5 1/4W  [R1206_ENKO]  -7.3,53.48 0 top
R44  1200970568**RES 0603 47K %5 1/10W  [R0603_ENKO]  -18.14,35.12 0 top
R45  1319-4060**Ferrite Bead SMD 0805 2kOhm@100MHz 300mA LAIRD HZ0805C202R-10  [R0805_ENKO]  -67.24,26.16 0 top
R46  1200970518**RES 0603 10K %5 1/10W  [R0603_ENKO]  -76.82,25.23 0 top
R47  1200971020**RES 0603 10K %1 1/10W  [R0603_ENKO]  -27,35.16 180 top
R48  1200970516**RES 0603 22K %5 1/10W  [R0603_ENKO]  -26.99,36.75 180 top
R49  1029-2005**RES 0603 220R %1  [R0603_ENKO]  -79.88,8.02 270 top
R50  1200970803**RES 0603 100K %1 1/10W  [R0603_ENKO]  -10.22,4.2 0 top
R51  1200971020**RES 0603 10K %1 1/10W  [R0603_ENKO]  -9.33,6.48 90 top
R52  1029-2005**RES 0603 220R %1  [R0603_ENKO]  -81.47,8.01 270 top
R53  1029-2005**RES 0603 220R %1  [R0603_ENKO]  -83.05,8 270 top
R54  1200971020**RES 0603 10K %1 1/10W  [R0603_ENKO]  -58.64,37.61 90 top
R55  1029-2233**RES 0603 2K2 %1  [R0603_ENKO]  -58.64,40.56 90 top
R56  1200970522**RES 0603 1K %5 1/10W  [R0603_ENKO]  -79.66,29.38 0 top
R57  1200970803**RES 0603 100K %1 1/10W  [R0603_ENKO]  -5.39,6.5 270 top
R58  1200970770**RES 0603 4K3 %1 1/10W  [R0603_ENKO]  -6.98,6.5 90 top
R59  1200970803**RES 0603 100K %1 1/10W  [R0603_ENKO]  -52.78,39.17 270 top
R60  1200970583**RES 0603 1K %1 1/10W  [R0603_ENKO]  -56.47,42.25 0 top
R61  1200970583**RES 0603 1K %1 1/10W  [R0603_ENKO]  -56.13,36.9 0 top
R62  1200970706**RES 0603 1K8 %5 1/10W  [R0603_ENKO]  -55.04,43.82 0 top
R63  1029-2003**RES 0603 10R %1  [R0603_ENKO]  -47.88,36.19 270 top
R64  1029-2006**RES 0603 47R %1  [R0603_ENKO]  -46.28,35.16 90 top
R65  1029-6021**RES 2512 0R003 %1 2W  [R2512]  -12.2,23.2 270 top
R66  1200970927**RES 0603 100R %1 1/10W  [R0603_ENKO]  -45.6,32.86 0 top
R67  1200970522**RES 0603 1K %5 1/10W  [R0603_ENKO]  -36.36,24.03 0 top
R68  1200970522**RES 0603 1K %5 1/10W  [R0603_ENKO]  -36.37,25.61 180 top
R69  1029-3116**RES 0805 10R %5  [R0805_ENKO]  -56.97,29.87 90 top
R70  1200971020**RES 0603 10K %1 1/10W  [R0603_ENKO]  -50.72,30.19 0 top
R71  1029-2234**RES 0603 4K7 %1  [R0603_ENKO]  -35.49,27.9 90 top
R72  1200970583**RES 0603 1K %1 1/10W  [R0603_ENKO]  -77.59,35.63 90 top
R73  1169-1001**TSM2A103F3951RZ THINKING 0805 10K NTC 125C  [R0805_ENKO]  -80.92,36.77 90 top
R74  1200970156**RES 1206 22K %5 1/4W  [R1206_ENKO]  -69.52,48.54 90 top
R75  1200970583**RES 0603 1K %1 1/10W  [R0603_ENKO]  -47.34,26.02 180 top
R76  1200970803**RES 0603 100K %1 1/10W  [R0603_ENKO]  -50.46,38.49 0 top
R77  1029-6089**RES 0603 6K8 %5  [R0603_ENKO]  -48.02,28.3 90 top
R78  1029-2203**RES 0603 12K %1  [R0603_ENKO]  -46.18,39.23 90 top
R79  1029-2341**RES 0603 5K6 %1  [R0603_ENKO]  -48.17,39.16 90 top
R80  1029-2234**RES 0603 4K7 %1  [R0603_ENKO]  -50.17,36.89 0 top
R81  1200970583**RES 0603 1K %1 1/10W  [R0603_ENKO]  -50.46,39.91 180 top
R82  1200971020**RES 0603 10K %1 1/10W  [R0603_ENKO]  -51.17,42.19 270 top
R83  1200970522**RES 0603 1K %5 1/10W  [R0603_ENKO]  -49.6,27.91 270 top
R84  1200970522**RES 0603 1K %5 1/10W  [R0603_ENKO]  -52.06,44.48 0 top
R85  1169-1006**FUSE SMD 1206 PTC RESETTABLE 16V IHOLD=0.75A IMAX=100A  [R1206_ENKO]  -62.93,15.76 270 top
R86  1200970522**RES 0603 1K %5 1/10W  [R0603_ENKO]  -3.17,36.28 270 top
R87  1200970518**RES 0603 10K %5 1/10W  [R0603_ENKO]  -8.2,36.29 90 top
R88  1029-2234**RES 0603 4K7 %1  [R0603_ENKO]  -58.76,12.94 0 top
R89  1200970583**RES 0603 1K %1 1/10W  [R0603_ENKO]  -58.65,7.96 180 top
R90  1029-2231**RES 0603 1K8 %1  [R0603_ENKO]  -57.75,5.67 90 top
R91  1200970518**RES 0603 10K %5 1/10W  [R0603_ENKO]  -47.88,19.05 0 top
R92  1200970568**RES 0603 47K %5 1/10W  [R0603_ENKO]  -45.48,17.46 270 top
R93  1409-0025**RES 0603 470R %5 1/16W  [R0603_ENKO]  -46.07,15.12 180 top
R94  1029-6086**RES 0603 22R %1  [R0603_ENKO]  -47.41,9.79 90 top
R95  1200970522**RES 0603 1K %5 1/10W  [R0603_ENKO]  -85.4,36.55 270 top
R96  1029-6086**RES 0603 22R %1  [R0603_ENKO]  -74.2,13.76 180 top
R97  1029-6086**RES 0603 22R %1  [R0603_ENKO]  -72.38,15.68 180 top
R98  1029-2234**RES 0603 4K7 %1  [R0603_ENKO]  -47.42,12.78 90 top
R99  1200970518**RES 0603 10K %5 1/10W  [R0603_ENKO]  -81.44,39.83 180 top
R100  1200970852**RES 0603 1K5 %5 1/10W ( <-1029-3501 )  [R0603_ENKO]  -76.48,13.05 270 top
R101  1200970684**RES 0603 47K %1 1/10W  [R0603_ENKO]  -49.05,13.65 270 top
R102  1200970583**RES 0603 1K %1 1/10W  [R0603_ENKO]  -51.18,15.76 270 top
R103  1200970522**RES 0603 1K %5 1/10W  [R0603_ENKO]  -84.55,51.94 90 top
R104  1200970522**RES 0603 1K %5 1/10W  [R0603_ENKO]  -86.15,51.93 270 top
R105  1029-2229**RES 0603 120K %1  [R0603_ENKO]  -52.62,12.97 180 top
R106  1029-2219**RES 0603 30K %1  [R0603_ENKO]  -52.77,15.74 90 top
R107  1200970515**RES 0603 100K %5 1/10W  [R0603_ENKO]  -39.69,11.17 180 top
R108  1200970730**RES 0603 560R %1 1/10W  [R0603_ENKO]  -55.77,12.94 180 top
R109  1200970518**RES 0603 10K %5 1/10W  [R0603_ENKO]  -42.05,16.11 90 top
R110  1200970516**RES 0603 22K %5 1/10W  [R0603_ENKO]  -42.83,19.1 270 top
R112  1200970154**RES 1206 2K2 %5 1/4W  [R1206_ENKO]  -38.7,9.29 180 top
R113  1200970121**RES 0805 1K %5 1/8W  [R0805_ENKO]  -35.87,20.3 180 top
R114  1200970518**RES 0603 10K %5 1/10W  [R0603_ENKO]  -35.51,18.46 180 top
R115  1200970853**RES 1206 39K %1 1/4W  [R1206_ENKO]  -34.99,11.83 0 top
R116  1200970585**RES 0603 1M %5 1/10W  [R0603_ENKO]  -29.39,15.19 270 top
R117  1029-6015**RES 1206 56K %5  [R1206_ENKO]  -35.77,5.47 90 top
R118  1029-6106**RES 2512 270mR %1 2W [ARGE?]  [R2512]  -14.08,103.57 90 top
R119  1029-6106**RES 2512 270mR %1 2W [ARGE?]  [R2512]  -10.03,103.55 90 top
R133  1200970626**RES 0603 82K %1 1/10W  [R0603_ENKO]  -67.44,39.05 90 top
R134  1029-2234**RES 0603 4K7 %1  [R0603_ENKO]  -72.55,39.66 0 top
R135  1200970940**RES 0603 6K8 %1 1/10W  [R0603_ENKO]  -77.54,38.99 90 top
R193  1200970934**RES 0603 470K %1 1/10W  [R0603_ENKO]  -72.55,41.17 0 top
R194  1200970528**RES 0603 0R %5 1/10W  [R0603_ENKO]  -80.05,42.1 270 top
RL1  1200930051**RELAY SPST 12V 5A 7x15x20.3mm  [ALD1_AND_ALJ_RELAY]  -6.1,20.6 270 top
STENCIL  041-7516**SDA381V2 için Çerçeveli Elek (Stencil) (600x600)  [PCB]  -332.91,-47.79 0 top
T1  1109-1016**Transistor NPN 3A 100V 15W Hfemin:10 DPAK Diodes MJD31C-13  [DPAK]  -81.82,74.7 0 top
T3  1200980091**TRANS SMD PNP BC857B SOT-23  [SOT23-BEC]  -55.86,39.35 270 top
T4  1200980090**TRANS SMD NPN BC847B SOT-23  [SOT23]  -47.96,42.48 180 top
T5  1200980090**TRANS SMD NPN BC847B SOT-23  [SOT23]  -5.57,35.99 180 top
T6  1200980090**TRANS SMD NPN BC847B SOT-23  [SOT23]  -85.25,39.82 90 top
T7  1200980090**TRANS SMD NPN BC847B SOT-23  [SOT23]  -38.37,14.46 270 top
T9  1200980090**TRANS SMD NPN BC847B SOT-23  [SOT23]  -35.77,15.82 180 top
T10  1049-1012**MMBTA56 PNP 80V 500mA 330mW hfe(min):100 SOT23  [SOT23-BEC]  -31.04,12.13 0 top
TP1  PTR1TP20R  [TP20R]  -52.04,22.08 0 top
TP4  PTR1TP20R  [TP20R]  -71.67,37.59 0 top
TRF1  0319-7452**SMPS TRAFO 150W E42/21/15 300uH DBC2 [ARGE?]  [DEIF_TRF]  -40.23,74.53 270 top
TVS1  1119-3061**5V 130W TVS Diode SOD-323  [SOD323]  -65.22,15.59 90 top
U1  1039-2220**STM32F072C8T6 64K Flash USB, CAN  [STM32F072CXXX_LQFP48]  -72.24,30.6 0 top
U2  1039-2392**LMR16006XDDCR 0.6A, 0.7MHz Step-Down Converter in a TSOT-6L, Input 4V to 60V  [AOZ1282CI-1]  -76.25,41.9 0 top
U$1  [SERI_NO_ETIKET_ALANI]  -34.88,73.75 180 bottom
U$2  [EN-KO_AMLEMI]  -89.03,63.23 0 top
U$3  [EN-KO_AMLEMI]  -83.67,59.08 0 bottom
U$4  [ROHS]  -85.22,105.11 0 bottom
U$5  [FT-ICT]  -51.94,73.47 0 bottom
X1  0289-1462**GMSTBA 2.5/ 3-G-7.62 (Phoenix 1766246)  [GMSTBA3]  -99.6,0.91 0 top
X2  0309-1064**USB Type-B Mini Connector Horizantal  [USB_B(YATIK)]  -68,5 90 top
X3  0289-1460**MSTBA 2.5/ 4-G-5.08 (Phoenix 1757268)  [MSTBA4]  -23.18,0.91 0 top
X4  0289-1464**MSTBA 2.5/ 3-G-5.08 (Phoenix 1757255)  [MSTBA3]  -48.13,0.91 0 top
XK1  0289-1463**GMVSTBR 2.5/ 3-ST-7.62 (Phoenix 1832536)  [SOKET]  -332.89,139.4 0 top
XK3  0289-1461**MVSTBR 2.5/ 4-ST-5.08 (Phoenix 1792265)  [SOKET]  -332.89,138.66 0 top
XK4  0289-1465**MVSTBR 2.5/ 3-ST-5.08 (Phoenix 1792252)  [SOKET]  -332.91,137.83 0 top
Z1  1129-1195**ZENER SOT23 18V 400mW %5 BZX84C18V  [SOT23]  -85,66.11 90 top
Z2  NC**TAKILMAYACAK (Not Fitted)  [SOT23]  -64.03,96.45 180 top
Z4  1129-1162**ZENER SOT23 3V9 300mW BZX84C3V9  [SOT23]  -48.5,16.64 270 top
Z5  1129-1145**ZENER SOT23 0.3W 15V BZX84C15  [SOT23]  -81.71,51.57 270 top
Z6  1129-1145**ZENER SOT23 0.3W 15V BZX84C15  [SOT23]  -84.9,43.14 90 top
Z7  1129-1151**ZENER SOT23 12V 225mW BZX84C12  [SOT23]  -39.35,19.97 180 top
Z8  1129-1140**ZENER SOT23 5V1 0.4W BZX84C5V1  [SOT23]  -32.59,15.82 180 top

## Tracks (layer width: path | path; a pad name or v marks a point on that pad's centre or on a via)
13.8V+  (via drill 0.35)
  Top 0.254: X3.1 -30.71,6.07 -30.16,6.07
  Top 0.305: -30.8,4.83 X3.1 | -29.94,3.68 -29.05,2.79 | -29.05,2.79 -11.77,2.79 | -11.77,2.79 -11.43,2.79 -11.01,3.21 R50.1 | -11.77,2.79 -11.19,3.37 -11.19,3.95 | -29.94,3.68 -30.47,3.68 | -30.47,3.68 -30.7,3.68 | -30.7,3.68 -31.13,3.68 | -31.13,3.68 -31.22,3.68 | -31.22,3.68 -31.49,3.68 | -31.49,3.68 -31.81,3.68 | -31.81,3.68 -32.16,3.68 | -32.16,3.68 -32.48,3.68 | -32.48,3.68 -32.56,3.68 | -32.56,3.68 -32.92,3.68 | -32.92,3.68 -33.32,3.68 | -33.32,3.68 -33.62,3.68 | -33.62,3.68 -34.02,3.68 | -34.02,3.68 -34.16,3.68 | -34.16,3.68 -34.47,3.99 | -30.8,4.11 -30.97,3.94 | -30.97,3.94 -31.22,3.68 | -30.8,4.01 -30.8,3.78 -30.7,3.68 | X3.1 -30.8,4.11 | -30.8,4.11 -30.8,4.01 | -30.8,4.01 -30.47,3.68 | X3.1 -30.8,4.54 -29.94,3.68 | -29.05,2.79 -29.48,2.79 | -29.48,2.79 -30.8,4.11 | -29.48,2.79 -29.82,2.79 | -29.82,2.79 -30.97,3.94 | -29.82,2.79 -30.24,2.79 | -31.13,3.68 -30.24,2.79 | -30.24,2.79 -30.6,2.79 | -30.6,2.79 -31.49,3.68 | -30.6,2.79 -30.92,2.79 | -30.92,2.79 -31.81,3.68 | -30.92,2.79 -31.27,2.79 | -31.27,2.79 -32.16,3.68 | -31.27,2.79 -31.59,2.79 | -31.59,2.79 -32.48,3.68 | -31.59,2.79 -32.03,2.79 | -32.92,3.68 -32.03,2.79 | -32.03,2.79 -32.43,2.79 | -32.43,2.79 -33.32,3.68 | -32.43,2.79 -32.73,2.79 | -32.73,2.79 -33.62,3.68 | -32.73,2.79 -33.13,2.79 | -33.13,2.79 -34.02,3.68 | -33.13,2.79 -33.27,2.79 -34.16,3.68 | -29.78,3.53 -30.16,3.9 -30.16,6.07 | -32.03,2.79 -32.03,3.15 -32.56,3.68 | -32.31,4.83 -31.15,5.99 | -31.15,5.99 X3.1 | X3.1 -31.34,5.45 -31.34,4.83 | -32.66,4.83 -31.5,5.99 -31.15,5.99
  Top 0.406: D7.A -62.07,48.45 -70.38,48.45 -71.1,49.17 | v-77.07,52.33 -76.43,52.33 | -76.43,52.33 -73.7,52.33 -71.1,49.73 -71.1,49.17 | -71.1,49.17 -74.26,52.33 -74.61,52.33 | -62.02,50.02 -61.89,50.02 -61.11,50.8 -61.02,50.8 -60.32,50.1 | -76.43,52.33 -77.02,52.5 v-77.07,52.33 | -76.43,52.33 -77.02,52.16 v-77.07,52.33
  Top 0.508: D7.A -61.11,49.52 | -40.69,55.92 -40.96,55.92 | -43.19,57.33 -43.92,56.59 -43.92,56.3 -43.46,55.84 | -43.19,57.33 TRF1.43 | -43.03,57.17 -43.19,57.33 | TRF1.22 -42.69,56.76 -42.26,56.32 -42.13,56.32 | -38.88,56.63 -39.36,56.15 -39.68,56.15 | -38.88,56.63 -38.06,57.45 | -38.06,57.45 TRF1.44 -37.18,57.24 -37.18,56.65 | -40.65,56.15 -40.26,56.15 | -40.26,56.15 -40.19,56.15 | -40.19,56.15 -39.68,56.15 | -39.73,56.63 -38.88,56.63 | -39.93,55.85 -39.39,55.85 | -39.39,55.85 -38.82,55.85 -38.39,56.28 | -38.39,56.28 -38.06,56.6 -38.06,57.45 | -39.06,56.28 -38.39,56.28 | -38.09,56.79 TRF1.21 -37.73,56.69 | -40.56,56.44 -42.78,56.54 -40.56,56.44 | -40.19,56.15 -39.52,55.97 | -39.52,55.97 -38.04,55.59 -40.19,56.15 | -40.19,56.15 -39.89,56.44 | -39.89,56.44 -38.59,57.69 -40.19,56.15 | -40.26,56.15 -40.56,56.44 | -40.56,56.44 -41.86,57.69 | -40.26,56.15 -42.41,55.59 | -40.93,55.97 -41.52,58.12 -40.93,55.97 | -40.56,56.44 -41.63,58.39 | -40.93,55.97 -43.07,56.59 | -39.68,56.15 -37.5,56.56 | -39.68,56.15 -38.89,58.23 | -39.39,55.85 -37.3,56.62 | -39.39,55.85 -38.95,58.03 | -39.52,55.97 -37.38,56.59 | -39.52,55.97 -38.93,58.12 | -39.89,56.44 -37.67,56.54 | -39.89,56.44 -38.82,58.39
  Top 0.61: R78.2 -44.91,40.03 v-44.9,40.04 | -80,52.93 -81.36,54.29 OC2.1 -81.36,53.46 -80.81,52.91 v-79.95,52.91 | D7.A -61.11,50.8 -61.11,52.68 -60.46,53.33 -46.19,53.33 | -46.19,53.33 -44.53,54.99 | -44.53,54.99 | -44.53,54.99 -43.96,55.55 | -43.96,55.55 TRF1.22 | -46.19,53.33 -45.49,53.33 | -42.86,55.96 -43.47,55.35 | -43.47,55.35 -44.15,54.67 | -44.15,54.67 -45.49,53.33 | -45.49,53.33 -44.72,53.33 | -44.72,53.33 -43.64,54.41 | -43.64,54.41 -42.81,55.24 | -42.81,55.24 -42.3,55.75 | -44.72,53.33 -44.4,53.33 | -44.4,53.33 -43.4,54.33 | -43.4,54.33 -42.48,55.25 | -42.48,55.25 -41.24,56.49 -41.51,56.76 -42.69,56.76 | -44.4,53.33 -43.55,53.33 | -40.96,55.92 -42.64,54.24 | -42.64,54.24 -43.55,53.33 | -43.55,53.33 -43.28,53.33 | -43.28,53.33 -42.34,54.27 | -42.34,54.27 -40.69,55.92 | -43.28,53.33 -42.45,53.33 -40.05,55.73 | -40.05,55.73 -39.93,55.85 | -44.53,54.99 | -43.41,55.33 -42.38,55.65 -43.41,55.33 | -44.53,54.99 -44.29,55.77 | -44.29,55.77 -43.87,57.14 -44.29,55.77 | -44.53,54.99 | -43.64,54.41 -42.69,55.23 | -43.89,57.53 | -42.69,55.23 | -42.69,55.23 | -42.69,55.23 -43.77,57.21 | -43.85,57.37 | -40.05,55.73 -39.16,55.68 | -39.16,55.68 -37.8,55.6 | -40.05,55.73 -39.7,56.18 | -39.7,56.18 -38.67,57.52 | -40.05,55.73 -39.16,55.68 | -39.16,55.68 -37.8,55.6 | -40.05,55.73 -39.7,56.18 | -39.7,56.18 -38.67,57.52 | -43.84,57.37 | -43.77,57.21 | -42.69,55.23 -43.77,57.21 | -43.77,57.21 | -44.53,54.99 -43.41,55.33 | -44.53,54.99 -44.29,55.77 | -44.53,54.99 -43.41,55.33 | -44.53,54.99 -44.29,55.77 | -44.15,54.67 -43.06,55.26 | -43.06,55.26 -42.16,55.74 | -44.15,54.67 -44.05,55.61 | -44.05,55.61 -43.91,56.91 | -43.64,54.41 -42.69,55.23 | -42.69,55.23 -41.94,55.89 | -43.64,54.41 -43.77,55.46
  Top 0.61: -43.77,55.46 -43.91,56.65 | -43.4,54.33 -42.54,55.24 | -42.54,55.24 -41.85,55.97 -42.54,55.24 | -43.4,54.33 | -43.64,55.41 -43.89,56.53 -43.64,55.41 | -43.4,54.33 -42.54,55.24 | -43.4,54.33 -43.64,55.41 | -42.64,54.24 -41.65,56.27 | -42.64,54.24 -43.24,55.29 | -43.24,55.29 -43.76,56.19 | -42.34,54.27 -41.96,55.35 | -41.96,55.35 -41.6,56.4 | -42.34,54.27 -43.07,55.26 | -43.07,55.26 -43.68,56.08 | -43.06,55.26 -41.75,57.09 | -42.69,55.23 | -42.69,55.23 -43.77,57.21 | -42.54,55.24 -41.63,57.3 -42.54,55.24 | -42.54,55.24 -43.74,57.15 -42.54,55.24 | -42.12,55.31 -43.62,56.99 | -43.41,55.33 -41.86,56.96 | -43.41,55.33 -43.89,57.53 | -44.29,55.77 -42.23,56.7 | -44.29,55.77 -43.9,57.99 | -43.06,55.26 -41.75,57.09 | -43.06,55.26 | -43.06,55.26 -43.84,57.37 | -43.06,55.26 -41.75,57.09 | -43.06,55.26 -43.84,57.37 | -44.05,55.61 -42.11,56.76 | -44.05,55.61 -43.92,57.85 | -42.69,55.23 -41.66,57.24 -42.69,55.23 | -42.69,55.23 -43.77,57.21 | -42.69,55.23 -43.77,57.21 | -43.77,55.46 -41.99,56.84 | -43.77,55.46 -43.92,57.7 | -43.64,55.41 -41.94,56.88 | -43.64,55.41 -43.91,57.64 | -42.12,55.31 -41.57,57.49 | -42.12,55.31 -43.62,56.99 | -43.24,55.29 -41.8,57.02 | -43.24,55.29 -43.87,57.45 | -41.96,55.35 -41.55,57.57 | -41.96,55.35 -43.56,56.93 | -43.07,55.26 -41.76,57.09 | -43.07,55.26 -43.85,57.37 | -43.96,55.55 -42.07,56.78 | -43.96,55.55 -43.92,57.81 | -43.47,55.35 -41.88,56.94 | -43.47,55.35 -43.9,57.56 | -42.81,55.24 -41.69,57.19 | -42.81,55.24 -43.8,57.26 | -42.48,55.25 -41.62,57.33 | -42.48,55.25 -43.72,57.13 | -39.16,55.68 -38.91,57.92 | -38.91,57.92 -39.16,55.68 | -39.7,56.18 -38.83,58.25 -39.7,56.18 | -39.16,55.68 -37.17,56.73 -39.16,55.68 | -39.16,55.68 -38.91,57.92
  Top 0.61: -39.7,56.18 -37.49,56.61 | -37.49,56.61 | -39.7,56.18 | -39.7,56.18 -37.49,56.61 | -40.05,55.73 -37.8,55.6 | -37.8,55.6 | -40.05,55.73 -38.67,57.52 | -40.05,55.73 -37.8,55.6 | -40.05,55.73 -38.67,57.52
  Top 0.813: C36.1 C37.1 -45.67,42.87 -45.08,42.28 v-43.88,42.28 | C72.2 -11.01,5.61 R50.1
  Top 1.016: X3.1 -30.8,4.93 -31.74,3.99 -34.47,3.99 R117.1 -35.77,4.54 -35.48,4.83 -32.66,4.83 -32.31,4.83 -31.34,4.83
  Bottom 0.406: v-44.9,40.04 -45.07,39.87 -45.07,39.8 -44.94,39.67 | v-77.07,52.33 -77.71,52.33 | -77.71,52.33 -79.53,52.33 -79.58,52.38 | -79.58,52.38 -80.03,52.83 v-79.95,52.91 | -77.71,52.33 -77.12,52.16 v-77.07,52.33 | -77.71,52.33 -77.12,52.5 v-77.07,52.33 | -79.58,52.38 -79.79,52.96 v-79.95,52.91 | -79.58,52.38 -80.06,52.77 v-79.95,52.91
  Bottom 1.5: -10.47,68.39 C73.1 -7.5,69.36 C18.P$1 -6.42,69.01 -7.04,68.39 -10.47,68.39 | C24.P$1 -16.43,69.62 -15.2,68.39 -10.47,68.39
  pour Bottom (isolate 0.305, no thermals): -38.06,35.95 -26.32,24.21 -25.47,24.21 -24.68,23.42 -24.68,16.58 -28.04,13.22 -27.96,1.41 -28.28,1.09 -39.45,1.09 -39.78,1.42 -39.78,17.14 -46.32,23.68 -46.32,39.99 -44.82,41.49 -38.2,41.49 -38.06,41.35
  pour Bottom (isolate 0.305, no thermals): -46.3,53.58 -44.24,55.64 -44.24,58.85 -43.93,59.16 -36.53,59.16 -36.24,58.87 -36.24,52.88 -34.24,50.88 -34.24,42.97 -38.06,39.15 -38.06,38.28 -38.43,37.91 -45.17,37.91 -46.3,39.04
  pour Top (isolate 0.305, no thermals): -62.57,54.52 -60.05,57.04 -60.05,59.44 -59.64,59.85 -44.43,59.85 -44.1,59.52 -44.1,55.84 -43.66,55.4 -36.71,55.4 -36.34,55.77 -36.34,60.32 -35.18,61.48 -16.74,61.48 -15.55,62.67 -15.55,71.17 -16.07,71.69 -16.77,71.69 -24.76,63.7 -59.06,63.7 -61.82,60.94 -61.82,57.85 -63.48,56.19 -66.74,56.19 -67.29,55.64 -67.29,55.03 -66.78,54.52
+3V3  (via drill 0.35)
  Top 0.254: -76.88,12.26 -76.66,12.26 R100.2 | -52.6,20.39 -53.4,21.18
  Top 0.305: R110.2 -42.95,18.31 -45.36,20.72 -46.47,20.72 -46.5,20.75 -46.52,20.75 -47.72,21.95 | -47.72,21.95 -48.05,22.28 v-48.05,22.5 | v-50.91,20.55 -51.07,20.39 -51.53,20.39 | -51.53,20.39 -52.6,20.39 -52.98,20.39 -53.5,20.91 -53.5,23.93 -53.94,24.37 -57.25,24.37 | C39.1 -78.91,26.51 -77.35,26.51 | C55.1 -74.99,35.88 U1.36 | U1.24 -65.62,33.35 C48.1 -66.65,33.44 -66.97,33.76 | IC4.3 -57.6,24.02 -57.25,24.37 | C54.1 -64.86,23.64 | U1.48 -76.49,27.37 -77.31,26.54 | -75.76,38.02 -75.65,38.13 C57.1 -75.39,37.87 -75.39,36.88 | v-67.43,34.22 -66.97,33.76 | -63.62,33.79 -63.62,35.63 -64.68,36.69 | v-82.47,36.68 -81.86,36.68 -81.84,36.7 -81.83,36.7 | -81.83,36.7 -79.98,36.7 -79.97,36.69 -78.46,36.69 | -77.59,36.56 -77.72,36.69 -78.46,36.69 | -57.25,24.37 -58.24,24.37 -58.36,24.25 | -77.61,25.74 -77.61,26.24 -77.53,26.33 | -77.35,26.51 -77.53,26.33 | -77.53,26.33 -78.64,26.33 | -77.31,26.54 -77.31,25.42 -77.53,25.2 | -77.31,26.54 -77.35,26.51 | D13.2 -64.95,36.97 -64.68,36.69 | -64.68,36.69 -65.63,36.69 | v-67.43,34.22 -67.06,33.85 -67.06,33.69 | -67.06,33.69 -67.06,33.41 | -78.46,36.69 -77.92,36.16 -77.78,36.16 | -75.65,37.1 -75.77,37.1 -76.44,36.42 -76.44,36.7 -75.65,37.49 -75.84,37.49 -76.91,36.42 | -47.72,21.95 | -47.72,21.95 -47.83,22.54 | -47.83,22.54 | v-48.05,22.5 -47.83,22.54 | -47.72,21.95 -48.19,22.32 | -48.19,22.32 | v-48.05,22.5 -48.19,22.32 | -47.72,21.95 -47.83,22.54 | v-48.05,22.5 -47.83,22.54 | -47.72,21.95 -48.19,22.32 | v-48.05,22.5 -48.19,22.32 | -51.53,20.39 -50.93,20.32 v-50.91,20.55 | -51.53,20.39 -51.04,20.73 v-50.91,20.55 | -81.83,36.7 -82.4,36.89 v-82.47,36.68 | -81.83,36.7 -82.38,36.47 v-82.47,36.68
  Top 0.305: -66.97,33.76 -67.22,34.31 v-67.43,34.22 | -66.97,33.76 -67.52,34.01 v-67.43,34.22 | -67.06,33.69 -67.21,34.27 v-67.43,34.22 | -67.06,33.69 -67.56,34.03 v-67.43,34.22
  Top 0.406: C45.1 -43.91,30.47 | -43.91,30.47 -43.91,30.08 -43.9,30.09 | -43.9,30.09 -43.87,30.12 -43.83,30.09 | -46.3,30.21 -46.18,30.09 -44.29,30.09 | -46.3,30.21 -46.33,30.24 | -46.33,30.24 -46.76,30.66 v-46.72,30.7 | -44.29,30.09 -43.9,30.09 | -63.62,33.79 C49.1 | -75.77,36.42 C55.1 | -43.9,30.09 -43.83,30.09 | -43.83,30.09 -43.22,30.09 | C45.1 -43.91,30.73 | -46.33,30.24 -46.56,30.77 v-46.72,30.7 | -46.33,30.24 -46.81,30.57 v-46.72,30.7 | PROG2.1 -84.77,27.08 v-84.37,27.08 | -43.22,30.09 -42.4,29.27 IC5.8 | -43.22,30.09 -43.91,30.78 C45.1 | -43.91,30.47 -44.29,30.09 | -46.3,30.21 -46.56,30.77 v-46.72,30.7 | -46.3,30.21 -46.82,30.56 v-46.72,30.7
  Top 0.508: C51.1 -64.77,23.56 C54.1 | -75.65,38.13 -75.65,37.49 | D13.2 -65.98,36.97
  Top 0.61: -64.39,24.02 C54.1 -65.45,24.33 -65.45,24.66 | -64.39,24.02 -63.8,24.6 | -63.8,24.6 -63.29,25.11 | IC4.3 -57.99,24.25 -58.36,24.25 -61.34,24.25 -62.1,25.01 v-62.1,25.12 -63.29,25.12 -63.29,25.11 | v-61.84,18.58 -64.05,18.58 -64.78,17.85 -78.12,17.85 -79.3,16.67 -79.3,12.72 v-79.26,12.68 -78.83,12.26 -76.66,12.26 | -79.19,26.33 C39.1 -78.64,26.33 -78.2,26.33 -77.61,25.74 R46.1 | LED1.2 -83,4 -82.57,3.57 -78.38,3.57 -77.65,4.3 -77.65,11.52 -76.91,12.26 -76.88,12.26 | C55.1 -75.65,37.1 -75.65,37.49 | -77.59,36.56 R72.2 -76.91,36.42 -76.44,36.42 -75.77,36.42 | C38.1 v-80.59,25.14 | C48.1 C49.1 | -65.45,24.66 -65.45,25.11 | R45.2 -66.19,25.84 -65.45,25.11 | -65.45,24.66 -65.03,24.66 | -65.03,24.66 -64.39,24.02 | -65.03,24.66 -63.86,24.66 -63.8,24.6 | -65.45,25.11 -63.29,25.11
  Top 0.813: C39.1 C38.1
  Bottom 0.305: -48.51,22.06 v-48.06,22.51 v-48.05,22.5 | -48.51,22.06 -50.02,20.55 -50.27,20.55 | -50.27,20.55 v-50.91,20.55 | -48.51,22.06 -47.96,22.29 v-48.05,22.5 | -48.51,22.06 -48.25,22.6 v-48.05,22.5 | -50.27,20.55 -50.83,20.76 v-50.91,20.55 | -50.27,20.55 -50.83,20.34 v-50.91,20.55
  Bottom 0.406: v-46.72,30.7 -46.72,30.16 | -46.74,30.09 -46.74,30.06 | -46.74,30.06 -46.74,30.03 -48.11,28.66 -48.11,23.14 | -48.11,23.14 -48.11,22.56 v-48.05,22.5 | -46.74,30.09 -46.72,30.16 | -46.72,30.16 -46.57,30.69 | v-46.72,30.7 -46.58,30.66 | -46.74,30.09 -46.9,30.65 v-46.72,30.7 | PROG1.1 -84.03,27.08 v-84.37,27.08 | -46.74,30.06 -46.55,30.65 v-46.72,30.7 | -46.74,30.06 -46.89,30.66 v-46.72,30.7 | -48.11,23.14 -48.22,22.53 v-48.05,22.5 | -48.11,23.14 -47.89,22.57 v-48.05,22.5
  Bottom 0.508: -82.34,27.06 -81.18,25.9 -81.18,25.72 -81.57,25.72 | -82.91,27.06 -81.57,25.72 | -81.57,25.72 -79.62,23.77 | -79.62,23.77 -79.23,23.77 | -79.62,23.77 -79.23,23.38 -79.23,22.81 | -81.94,27.06 -81.18,27.82 -81.18,28.04
  Bottom 0.61: v-61.84,18.58 -61.72,18.7 -61.72,24.55 -62.1,24.93 v-62.1,25.12 -62.77,25.79 -62.77,27.72 -63.66,28.61 -66.3,28.61 -68.26,30.57 -68.26,33.4 -67.44,34.22 v-67.43,34.22 | v-79.26,12.68 -79.17,12.77 -79.17,22.75 -79.23,22.81 -79.23,23.77 v-80.59,25.14 -81.18,25.72 -81.18,26.57 | -81.18,26.57 -81.18,28.04 -81.18,33.87 -82.47,35.16 v-82.47,36.68 | PROG1.1 -82.91,27.06 -82.34,27.06 -81.94,27.06 -81.67,27.06 -81.18,26.57
AUX1
  Top 1.016: -81.64,86.36 -81.5,86.36 -72.8,86.36 -67.78,91.38 R20.2
  Top 1.27: R19.2 -81.64,86.36 | -81.5,86.36 D1.A
BOOST_INP
  Top 0.254: -50.32,21.59 -50.82,22.08 TP1.TP -51.14,22.08 -50.05,20.99 | -50.05,19.91 -49.36,19.22 -49.36,19.08 | -50.05,20.24 -48.89,19.08 -48.71,19.08
  Top 0.305: C63.1 -50.05,19.08 -50.05,19.91 -50.05,20.24 -50.05,20.99 -50.05,21.31 -50.32,21.59 -51.41,22.68 | -51.41,22.68 -53.98,25.24 -56.94,25.24 -58.88,27.19 -59.59,27.19 -61.26,28.85 U1.15 | TP1.TP -51.44,22.68 -51.41,22.68
  Top 0.508: -50.01,19.05 -50.05,19.08
  Top 0.813: R91.1 -48.71,19.08 -49.36,19.08 -50.05,19.08
CUT_OFF_OUTPUT  (via drill 0.35)
  Top 0.305: -42.83,21.14 C71.1 | v-48.78,20.34 -48.78,20.87 -48.88,20.97 | -48.88,20.97 -53.73,25.82 -56.67,25.82 -58.62,27.77 -59.3,27.77 -60.88,29.35 U1.16 | -48.88,20.97 -49,20.38 v-48.78,20.34 | -48.88,20.97 -48.58,20.45 v-48.78,20.34
  Top 0.508: v-43.74,13.85 -43.74,13.76 -43.73,13.75 -43.33,13.75 | -43.33,13.75 -43.22,13.75 | -43.22,13.75 -43.1,13.75 | -43.1,13.75 -42.89,13.75 D14.A | -43.33,13.75 -43.72,13.89 v-43.74,13.85 | -43.22,13.75 -43.71,13.93 v-43.74,13.85 | -43.1,13.75 -43.7,13.97 v-43.74,13.85 | -43.1,13.75 -43.74,13.73 v-43.74,13.85
  Top 0.61: C71.1 -43.25,21.56 v-46.18,21.56
  Top 0.813: R110.1 -42.83,21.14
  Bottom 0.305: v-46.18,21.56 -46.11,21.56 -45.69,21.14 | -45.69,21.14 -43.53,18.98 -43.53,14.46 | -43.53,14.46 -43.53,14.06 v-43.74,13.85 | v-46.18,21.56 -46.63,21.11 | -46.63,21.11 -47.31,20.43 -48.14,20.43 | v-48.78,20.34 -48.69,20.43 -48.14,20.43 | -45.69,21.14 -45.98,21.67 v-46.18,21.56 | -45.69,21.14 -46.26,21.35 v-46.18,21.56 | -46.63,21.11 -46.09,21.35 v-46.18,21.56 | -46.63,21.11 -46.39,21.65 v-46.18,21.56 | -43.53,14.46 -43.91,13.99 v-43.74,13.85 | -43.53,14.46 -43.51,13.86 v-43.74,13.85 | -48.14,20.43 -48.73,20.56 v-48.78,20.34 | -48.14,20.43 -48.67,20.14 v-48.78,20.34
DRAIN1
  Top 1.27: -25.16,98.8 D4.A -25.02,98.22
  pour Bottom (isolate 0.305, no thermals): -15.72,86.55 -15.22,87.05 -15.22,87.75 -15.74,88.27 -21.02,88.27 -21.34,88.59 -21.35,88.6 -21.35,89.14 -21.35,92.52 -21.6,92.77 -21.6,93.75 -21.78,93.93 -23.76,93.93 -23.86,93.83 -23.86,92.74 -24.1,92.5 -24.1,86.76 -23.92,86.58 -23.89,86.55
  pour Top (isolate 0.305, no thermals): -22.69,100.84 -23.17,100.36 -23.64,99.89 -25.29,99.89 -25.83,99.35 -25.83,98.17 -25.83,97 -24.54,95.71 -24.11,95.28 -24.11,92.04 -24.11,86.6 -23.93,86.42 -15.83,86.42 -15.21,87.04 -15.21,87.75 -15.73,88.27 -21.02,88.27 -21.35,88.6 -21.35,88.76 -21.4,88.81 -21.4,105.79 -21.4,106.1 -21.85,106.55 -22.29,106.55 -22.6,106.24 -22.69,106.15
FB  (via drill 0.35)
  Top 0.406: -59.73,97.96 C8.1 -59.59,97.44 -62.88,94.14 -62.88,92.64 | OC2.4 -81.36,65.65 -80,67.01 | -80,67.01 -78.22,67.01 -75.01,70.22 -75.01,81.12 -73.34,82.78 | -73.63,76.2 -73.63,77.31 -72.51,78.43 -72.08,78.43 | -73.63,76.2 -73.63,69.44 | -73.63,69.44 -73.63,68.98 | -73.63,68.98 -73.63,68.45 | -73.63,68.45 -73.63,68.02 OC1.4 | -72.08,78.43 -71.91,78.43 | -71.4,78.43 -71.91,78.43 | -70.23,79.6 -71.4,78.43 | -70.23,79.6 -70.23,80.15 | -70.23,80.15 -70.23,81.61 | -70.23,81.61 -70.23,81.95 | -70.23,81.95 -70.23,82.26 | -70.23,82.26 -70.23,82.64 -70.08,82.78 | -64.72,89.32 -64.72,89.7 -64.93,89.91 v-64.99,89.91 | -64.72,89.32 -64.72,85.5 -66.14,84.08 -68.41,84.08 | -68.41,84.08 -68.79,84.08 | -70.08,82.78 -69.78,83.09 | -69.78,83.09 -69.51,83.36 | -69.51,83.36 -69.34,83.53 | -69.34,83.53 -69.08,83.8 | -69.08,83.8 -68.79,84.08 | -73.34,82.78 -70.08,82.78 | -80,67.01 -80.5,67.01 | -81.43,66.08 -80.5,67.01 | -80.5,67.01 -80.96,67.01 -81.75,66.22 | -73.63,68.45 -76.05,66.03 | -76.05,66.03 -76.05,65.92 | -73.63,68.98 -76.05,66.56 | -76.05,66.03 -76.05,66.56 | -76.05,66.56 -76.53,66.08 | -76.53,66.08 -76.53,65.96 | -73.63,69.44 -76.53,66.54 -76.53,66.08 | -73.34,82.78 -73.03,83.09 | -73.03,83.09 -69.78,83.09 | -73.03,83.09 -72.77,83.36 | -72.77,83.36 -69.51,83.36 | -72.77,83.36 -72.6,83.53 | -72.6,83.53 -69.34,83.53 | -72.6,83.53 -72.33,83.8 | -72.33,83.8 -69.08,83.8 | -72.33,83.8 -72.05,84.08 -68.79,84.08 | -70.23,82.26 -68.41,84.08 | -70.23,81.95 -68.1,84.08 -67.92,84.08 | -70.23,81.61 -69.88,81.97 | -69.88,81.97 -67.76,84.08 -67.18,84.08 | -72.08,78.43 -73.63,76.88 | -73.63,76.88 -73.63,76.25 | -71.4,78.43 -73.63,76.2 | -71.91,78.43 -73.46,76.88 -73.63,76.88
  Top 0.406: -71.91,78.43 -71.91,78.47 -70.23,80.15 | -69.88,81.97 -69.88,79.95 -70.23,79.6 | -62.88,92.64 -62.88,92.17 v-63.04,92.01 | -64.72,89.32 -64.82,89.94 v-64.99,89.91 | -64.72,89.32 -65.12,89.79 v-64.99,89.91 | -62.88,92.64 -63.19,92.1 v-63.04,92.01 | -62.88,92.64 -62.87,92.02 v-63.04,92.01
  Top 0.61: IC1.2 -59.73,97.96
  Bottom 0.406: v-64.99,89.91 v-64.98,89.92 -64.93,89.92 -64.51,90.34 | v-63.04,92.01 -63.04,91.81 -63.38,91.47 | -63.38,91.47 -64.51,90.34 | -64.51,90.34 -65.07,90.06 v-64.99,89.91 | -64.51,90.34 -64.84,89.81 v-64.99,89.91 | -63.38,91.47 -62.92,91.88 v-63.04,92.01 | -63.38,91.47 -63.21,92.06 v-63.04,92.01
GATE1
  Top 0.406: R116.2 -29.74,14.39 | Z8.3 -32.58,14.73
  Top 0.61: T9.3 Z8.3 | R107.1 -38.9,11.41 -37.75,12.56 -37.75,13.87 -37.27,14.36 T7.3
  Top 0.813: IC8.GATE -27.23,14.96 -27.83,14.36 -29.36,14.36 R116.2 -29.72,14.72 Z8.3 | T7.3 -36.03,14.46 T9.3
GND  (via drill 0.35)
  Top 0.305: -54.57,99.44 C9.1